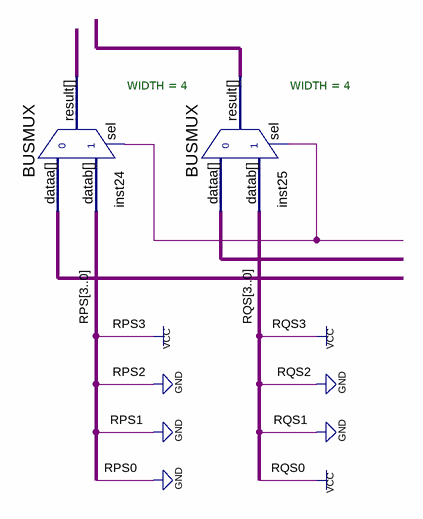
[diagram p0: schematic sheet]
// Quartus schematic tmp.bdf as structural Verilog: 2 symbols, 0 pins
module tmp (
);

  wire undriven;
  wire [3:0] inst24_result, inst25_result, undriven_2, undriven_3;

  BUSMUX #(.WIDTH(4)) inst24 (.datab(4'b1000), .sel(undriven), .dataa(undriven_3), .result(inst24_result));
  BUSMUX #(.WIDTH(4)) inst25 (.datab(4'b1001), .sel(undriven), .dataa(undriven_2), .result(inst25_result));
endmodule
